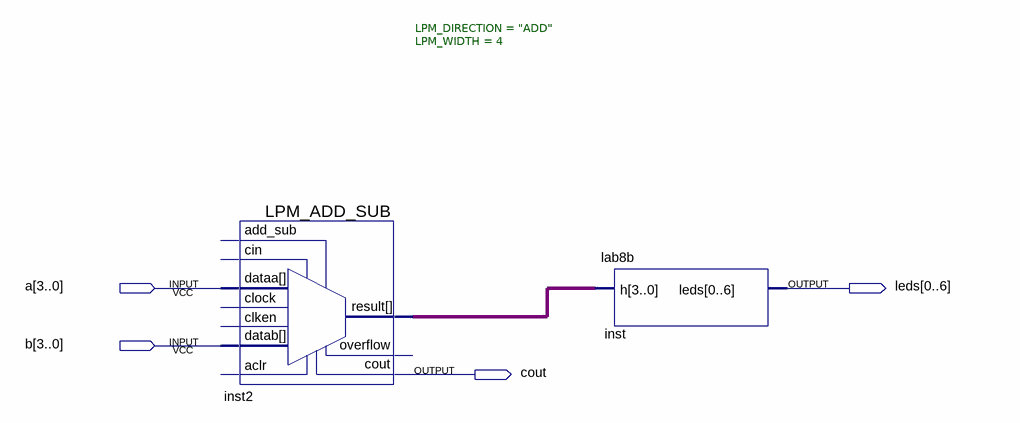
[diagram p0: schematic sheet]
// Quartus schematic lab8c.bdf as structural Verilog: 2 symbols, 4 pins
module lab8c (
  input  [3:0] a,
  input  [3:0] b,
  output [0:6] leds,
  output cout
);

  wire [3:0] inst2_result;

  LPM_ADD_SUB #(.LPM_DIRECTION("ADD"), .LPM_WIDTH(4)) inst2 (
    .datab(b), .dataa(a), .cout(cout), .result(inst2_result));  // open: add_sub, cin, aclr, clock, clken, overflow
  lab8b inst (.h(inst2_result), .leds(leds));
endmodule
